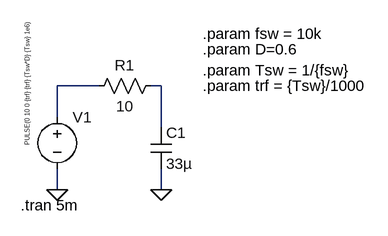
[diagram p0: schematic ModelSimulRC.asc]
ModelSimulRC.asc, the LTspice schematic file:
Version 4.1
SHEET 1 880 680
WIRE 144 96 80 96
WIRE 240 96 224 96
WIRE 80 144 80 96
WIRE 240 160 240 96
WIRE 80 256 80 224
WIRE 240 256 240 224
FLAG 80 256 0
FLAG 240 256 0
SYMBOL voltage 80 128 R0
WINDOW 3 -46 -132 VRight 0
WINDOW 123 0 0 Left 0
WINDOW 39 0 0 Left 0
SYMATTR Value PULSE(0 10 0 {trf} {trf} {Tsw*D} {Tsw} 1e6)
SYMATTR InstName V1
SYMBOL res 240 80 R90
WINDOW 0 0 56 VBottom 2
WINDOW 3 32 56 VTop 2
SYMATTR InstName R1
SYMATTR Value 10
SYMBOL cap 224 160 R0
SYMATTR InstName C1
SYMATTR Value 33µ
TEXT 304 16 Left 2 !.param fsw = 10k
TEXT 304 96 Left 2 !.param trf = {Tsw}/1000
TEXT 304 72 Left 2 !.param Tsw = 1/{fsw}
TEXT 304 40 Left 2 !.param D=0.6
TEXT 24 280 Left 2 !.tran 5m

The netlist it stands for:
* ModelSimulRC.asc
V1 N001 0 PULSE(0 10 0 {trf} {trf} {Tsw*D} {Tsw} 1e6)
R1 N002 N001 10
C1 N002 0 33µ
.param fsw = 10k
.param trf = {Tsw}/1000
.param Tsw = 1/{fsw}
.param D=0.6
.tran 5m
.backanno
.end